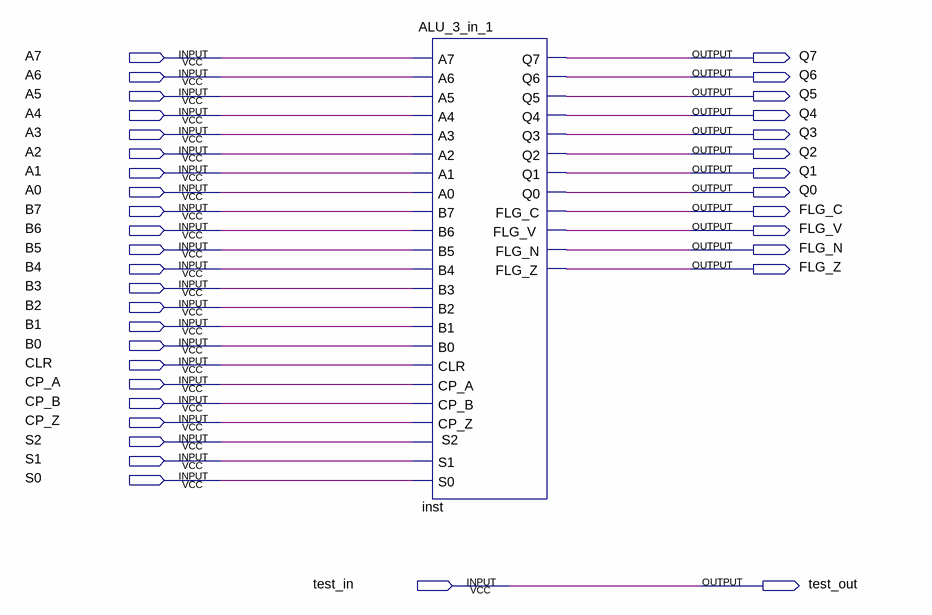
[diagram p0: schematic sheet]
// Quartus schematic test_ALU.bdf as structural Verilog: 1 symbols, 37 pins
module test_ALU (
  input  A7,
  input  A6,
  input  A5,
  input  A4,
  input  A3,
  input  A2,
  input  A1,
  input  A0,
  input  B7,
  input  B6,
  input  B5,
  input  B4,
  input  B3,
  input  B2,
  input  B1,
  input  B0,
  input  CLR,
  input  CP_A,
  input  CP_B,
  input  CP_Z,
  input  S2,
  input  S1,
  input  S0,
  input  test_in,
  output Q7,
  output Q6,
  output Q5,
  output Q4,
  output Q3,
  output Q2,
  output Q1,
  output Q0,
  output FLG_C,
  output FLG_V,
  output FLG_N,
  output FLG_Z,
  output test_out
);

  ALU_3_in_1 inst (
    .A0(A0), .A1(A1), .A2(A2), .A3(A3), .A4(A4), .A5(A5), .A6(A6), .A7(A7), .B0(B0), .B1(B1), .B2(B2),
    .B3(B3), .B4(B4), .B5(B5), .B6(B6), .B7(B7), .CLR(CLR), .CP_A(CP_A), .CP_B(CP_B), .CP_Z(CP_Z), .S1(S1),
    .S0(S0), .S2(S2), .Q0(Q0), .Q1(Q1), .Q2(Q2), .Q3(Q3), .Q4(Q4), .Q5(Q5), .Q6(Q6), .Q7(Q7), .FLG_V(FLG_V),
    .FLG_N(FLG_N), .FLG_Z(FLG_Z), .FLG_C(FLG_C));

  assign test_out = test_in;
endmodule
